# Altium schematic sheet Tubes 1-3.SchDoc
size A
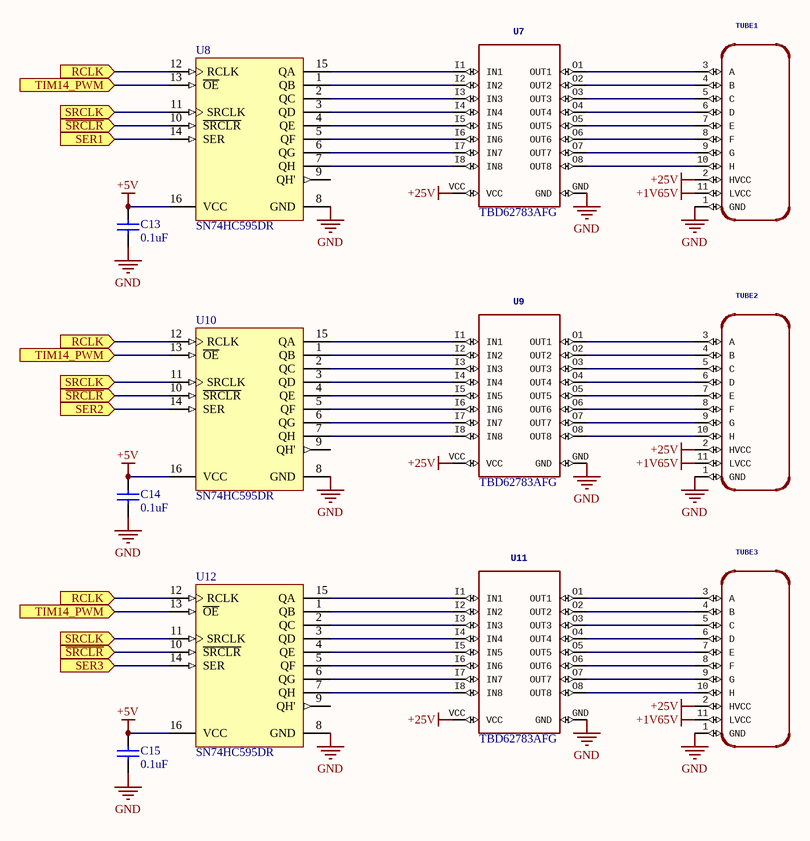
[diagram p0: Tubes 1-3.SchDoc]

## Parts
C13  0.1uF  [CAPC1608X90X40ML10T20]
C14  0.1uF  [CAPC1608X90X40ML10T20]
C15  0.1uF  [CAPC1608X90X40ML10T20]
TUBE1  VFD-IV-11  [VFD-IV11]  (value not drawn)
TUBE2  VFD-IV-11  [VFD-IV11]  (value not drawn)
TUBE3  VFD-IV-11  [VFD-IV11]  (value not drawn)
U7  TBD62783AFG  [TBD62783AFG]
U8  SN74HC595DR  [D0016A_N]
U9  TBD62783AFG  [TBD62783AFG]
U10  SN74HC595DR  [D0016A_N]
U11  TBD62783AFG  [TBD62783AFG]
U12  SN74HC595DR  [D0016A_N]

## Ports
RCLK (in), SER1 (in), SER2 (in), SER3 (in), SRCLK (in), TIM14_PWM (in), ~{SRCLR} (in)

## Nets
+1V65V: TUBE1.11(LVCC) TUBE2.11(LVCC) TUBE3.11(LVCC)
+5V: C13.2 C14.2 C15.2 U8.16(VCC) U10.16(VCC) U12.16(VCC)
+25V: TUBE1.2(HVCC) TUBE2.2(HVCC) TUBE3.2(HVCC) U7.VCC U9.VCC U11.VCC
GND: C13.1 C14.1 C15.1 TUBE1.1(GND) TUBE2.1(GND) TUBE3.1(GND) U7.GND U8.8(GND) U9.GND U10.8(GND) U11.GND U12.8(GND)
~{SRCLR}: U8.10(~{SRCLR}) U10.10(~{SRCLR}) U12.10(~{SRCLR}) ; port ~{SRCLR}
RCLK: U8.12(RCLK) U10.12(RCLK) U12.12(RCLK) ; port RCLK
SER1: U8.14(SER) ; port SER1
SER2: U10.14(SER) ; port SER2
SER3: U12.14(SER) ; port SER3
SRCLK: U8.11(SRCLK) U10.11(SRCLK) U12.11(SRCLK) ; port SRCLK
TIM14_PWM: U8.13(~{OE}) U10.13(~{OE}) U12.13(~{OE}) ; port TIM14_PWM
NetTUBE1_3: TUBE1.3(A) U7.O1(OUT1)
NetTUBE1_4: TUBE1.4(B) U7.O2(OUT2)
NetTUBE1_5: TUBE1.5(C) U7.O3(OUT3)
NetTUBE1_6: TUBE1.6(D) U7.O4(OUT4)
NetTUBE1_7: TUBE1.7(E) U7.O5(OUT5)
NetTUBE1_8: TUBE1.8(F) U7.O6(OUT6)
NetTUBE1_9: TUBE1.9(G) U7.O7(OUT7)
NetTUBE1_10: TUBE1.10(H) U7.O8(OUT8)
NetTUBE2_3: TUBE2.3(A) U9.O1(OUT1)
NetTUBE2_4: TUBE2.4(B) U9.O2(OUT2)
NetTUBE2_5: TUBE2.5(C) U9.O3(OUT3)
NetTUBE2_6: TUBE2.6(D) U9.O4(OUT4)
NetTUBE2_7: TUBE2.7(E) U9.O5(OUT5)
NetTUBE2_8: TUBE2.8(F) U9.O6(OUT6)
NetTUBE2_9: TUBE2.9(G) U9.O7(OUT7)
NetTUBE2_10: TUBE2.10(H) U9.O8(OUT8)
NetTUBE3_3: TUBE3.3(A) U11.O1(OUT1)
NetTUBE3_4: TUBE3.4(B) U11.O2(OUT2)
NetTUBE3_5: TUBE3.5(C) U11.O3(OUT3)
NetTUBE3_6: TUBE3.6(D) U11.O4(OUT4)
NetTUBE3_7: TUBE3.7(E) U11.O5(OUT5)
NetTUBE3_8: TUBE3.8(F) U11.O6(OUT6)
NetTUBE3_9: TUBE3.9(G) U11.O7(OUT7)
NetTUBE3_10: TUBE3.10(H) U11.O8(OUT8)
NetU7_I1: U7.I1(IN1) U8.15(QA)
NetU7_I2: U7.I2(IN2) U8.1(QB)
NetU7_I3: U7.I3(IN3) U8.2(QC)
NetU7_I4: U7.I4(IN4) U8.3(QD)
NetU7_I5: U7.I5(IN5) U8.4(QE)
NetU7_I6: U7.I6(IN6) U8.5(QF)
NetU7_I7: U7.I7(IN7) U8.6(QG)
NetU7_I8: U7.I8(IN8) U8.7(QH)
NetU9_I1: U9.I1(IN1) U10.15(QA)
NetU9_I2: U9.I2(IN2) U10.1(QB)
NetU9_I3: U9.I3(IN3) U10.2(QC)
NetU9_I4: U9.I4(IN4) U10.3(QD)
NetU9_I5: U9.I5(IN5) U10.4(QE)
NetU9_I6: U9.I6(IN6) U10.5(QF)
NetU9_I7: U9.I7(IN7) U10.6(QG)
NetU9_I8: U9.I8(IN8) U10.7(QH)
NetU11_I1: U11.I1(IN1) U12.15(QA)
NetU11_I2: U11.I2(IN2) U12.1(QB)
NetU11_I3: U11.I3(IN3) U12.2(QC)
NetU11_I4: U11.I4(IN4) U12.3(QD)
NetU11_I5: U11.I5(IN5) U12.4(QE)
NetU11_I6: U11.I6(IN6) U12.5(QF)
NetU11_I7: U11.I7(IN7) U12.6(QG)
NetU11_I8: U11.I8(IN8) U12.7(QH)

Not connected (* = marked no-connect by the designer): U8 9(QH'); U10 9(QH'); U12 9(QH')

## Library data of the parts
C13-C15 = CMP-2000-05002-1: Ceramic Multilayer Capacitor, 100 nF, +/- 10%, 50 V, -55 to 155 degC, 0603 (1608 Metric), RoHS, Tape and Reel; Manufacturer: Yageo; Online Catalog: CCSeries; Voltage - Rated: 16V; Product Training Modules: MultilayerCeramicCapacitors; Other Names: 311-1088-6; Featured Product: CommodityMultilayerCeramicCapacitors–CCSeries; Capacitance: 0.1µF; Temperature Coefficient: X7R; Height - Seated (Max): -; Operating Temperature: -55degC~125degC; Package / Case: 0603(1608Metric); Datasheet URL: https://datasheet.ciiva.com/11786/0900766b80d84f1d-11786077.pdf; Package Description: 2-Pin Surface Mount Device, Body 1.6 x 0.8 mm; Family: CeramicCapacitors; Packaging: Digi-Reel; Size / Dimension: 0.063"Lx0.031"W(1.60mmx0.80mm); Thickness (Max): 0.035"(0.90mm); Series: CC; Lead Spacing: -; Features: -; Tolerance: ±10%; Lead Style: -; Ratings: -; Manufacturer URL: http://www.yageo.com/; Package Reference: 603; Standard Package: 1; Category: Capacitors; Mounting Type: SurfaceMount,MLCC; Applications: GeneralPurpose; Datasheet Version: Rev. 2, 05/2009
TUBE1-TUBE3 = VFD-IV-11: GateName_1: G$1; SymbolName_1: VFD-IV11; LibraryName: VFD-Clock; DeviceSetName: VFD-IV-11; Package: VFD-IV11
U7 = TBD62783AFG: TUBE1; GateName_1: G$1; SymbolName_1: TBD62783AFG; LibraryName: TBD62783AFG; DeviceSetName: TBD62783AFG; Package: TBD62783AFG
U8 U10 U12 = CMP-0780-00037-3: 8-Bit Shift Registers With 3-State Output Registers, D0016A, LARGE T&R; Manufacturer: Texas Instruments; Output Drive (IOL/IOH)(Max)(mA): 7.8/-7.8; Rating: Military; ICC @ Nom Voltage(Max)(mA): 0.08; VCC(Min)(V): 2; tpd @ Nom Voltage(Max)(ns): 34; 3-State Output: Yes; Output Type: CMOS; Voltage(Nom)(V): 6; F @ Nom Voltage(Max)(Mhz): 28; Technology Family: HC; Bits: 4; PackageReference: D0016A; Code_JEDEC: MS-012 variation AC; Generic Part Number: SN74HC595; Operating Temperature Range(C): -40 to 85; DatasheetVersion: SCLS041H; PackageVersion: http://www.ti.com/lit/ml/mpds178g/mpds178g.pdf; Input Type: CMOS; VCC(Max)(V): 6
U9 = TBD62783AFG: TUBE2; GateName_1: G$1; SymbolName_1: TBD62783AFG; LibraryName: TBD62783AFG; DeviceSetName: TBD62783AFG; Package: TBD62783AFG
U11 = TBD62783AFG: TUBE3; GateName_1: G$1; SymbolName_1: TBD62783AFG; LibraryName: TBD62783AFG; DeviceSetName: TBD62783AFG; Package: TBD62783AFG